# EAGLE design mubi-bot-PICO-3 (EAGLE 7.2.0)
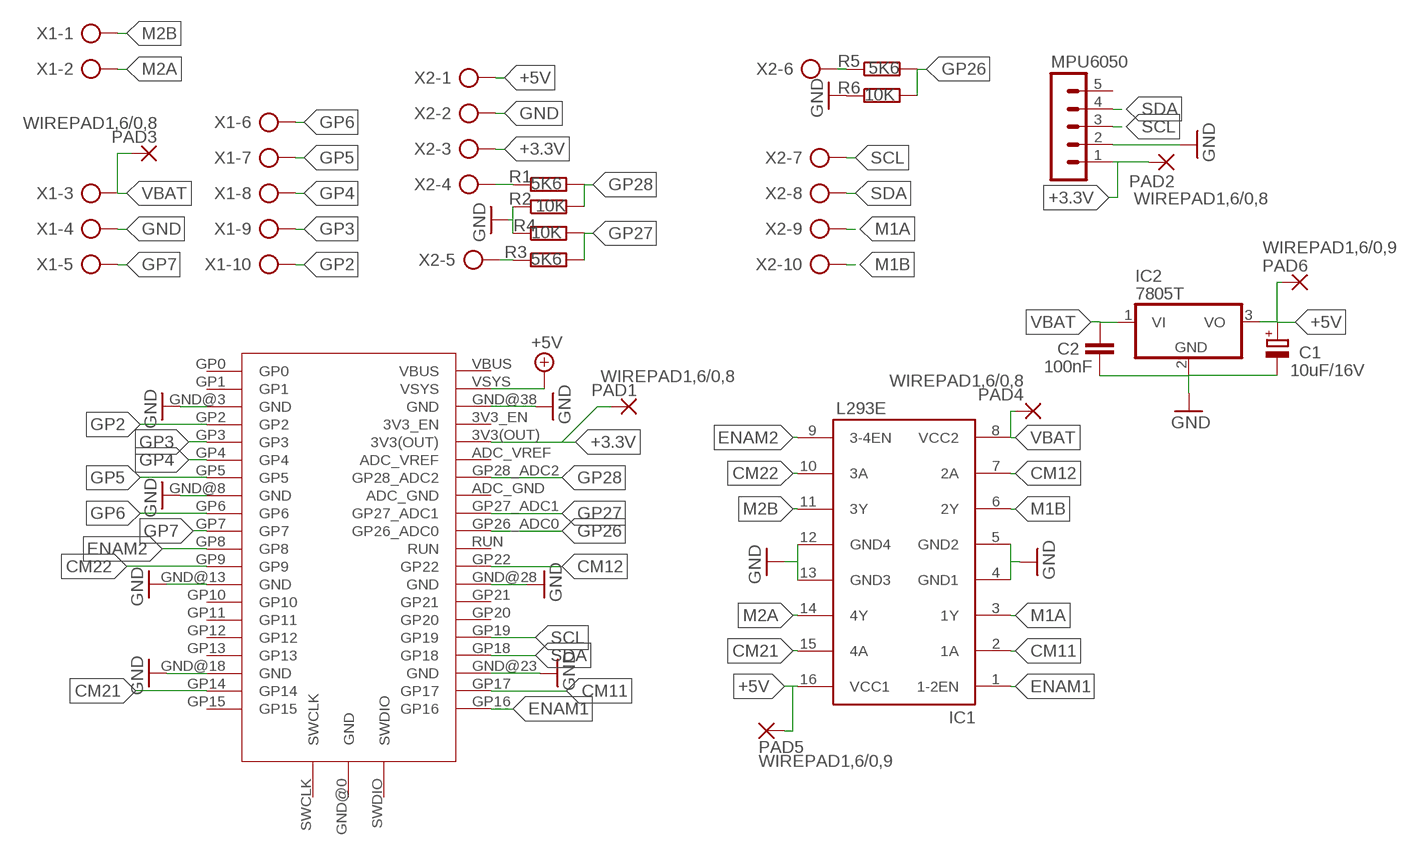
[diagram p0: schematic, sheet 1]

## Parts
C1  10uF/16V  CPOL-EUE2.5-5  [E2,5-5]
C2  100nF  C-EU025-025X050  [C025-025X050]
IC1  L293E  [DIL16]
IC2  7805T  [TO220H]
MPU6050  MA05-1  [MA05-1]
PAD1  WIREPAD1,6/0,8  [1,6/0,8]
PAD2  WIREPAD1,6/0,8  [1,6/0,8]
PAD3  WIREPAD1,6/0,8  [1,6/0,8]
PAD4  WIREPAD1,6/0,8  [1,6/0,8]
PAD5  WIREPAD1,6/0,9  [1,6/0,9]
PAD6  WIREPAD1,6/0,9  [1,6/0,9]
R1  5K6  R-EU_0204/5  [0204/5]
R2  10K  R-EU_0204/5  [0204/5]
R3  5K6  R-EU_0204/5  [0204/5]
R4  10K  R-EU_0204/5  [0204/5]
R5  5K6  R-EU_0204/5  [0204/5]
R6  10K  R-EU_0204/5  [0204/5]
U$2  RASPBERRY_PI_PICO  [RASPBERRY_PI_PICO_FOOTPRINT]
X1  AK500/10-H  [AK500/10-H]
X2  AK500/10-H  [AK500/10-H]

## Nets
+3.3V: MPU6050.1 PAD1.1(P) PAD2.1(P) U$2.3V3(OUT) X2.3
+5V: C1.+ IC1.16(VCC1) IC2.3(VO) PAD5.1(P) PAD6.1(P) U$2.VSYS X2.1
CM11: IC1.2(1A) U$2.GP17
CM12: IC1.7(2A) U$2.GP22
CM21: IC1.15(4A) U$2.GP14
CM22: IC1.10(3A) U$2.GP9
ENAM1: IC1.1(1-2EN) U$2.GP16
ENAM2: IC1.9(3-4EN) U$2.GP8
GND: C1.- C2.2 IC1.4(GND1) IC1.5(GND2) IC1.12(GND4) IC1.13(GND3) IC2.2(GND) MPU6050.2 R2.1 R4.1 R6.1 U$2.GND@3(GND) U$2.GND@8(GND) U$2.GND@13(GND) U$2.GND@18(GND) U$2.GND@23(GND) U$2.GND@28(GND) U$2.GND@38(GND) X1.4 X2.2
GP2: U$2.GP2 X1.10
GP3: U$2.GP3 X1.9
GP4: U$2.GP4 X1.8
GP5: U$2.GP5 X1.7
GP6: U$2.GP6 X1.6
GP7: U$2.GP7 X1.5
GP26: R5.2 R6.2 U$2.GP26_ADC0
GP27: R3.2 R4.2 U$2.GP27_ADC1
GP28: R1.2 R2.2 U$2.GP28_ADC2
M1A: IC1.3(1Y) X2.9
M1B: IC1.6(2Y) X2.10
M2A: IC1.14(4Y) X1.2
M2B: IC1.11(3Y) X1.1
N$1: R1.1 X2.4
N$2: R3.1 X2.5
N$3: R5.1 X2.6
SCL: MPU6050.3 U$2.GP19 X2.7
SDA: MPU6050.4 U$2.GP18 X2.8
VBAT: C2.1 IC1.8(VCC2) IC2.1(VI) PAD3.1(P) PAD4.1(P) X1.3
Unconnected: MPU6050.5 U$2.3V3_EN U$2.ADC_GND U$2.ADC_VREF U$2.GND@0(GND) U$2.GP0 U$2.GP1 U$2.GP10 U$2.GP11 U$2.GP12 U$2.GP13 U$2.GP15 U$2.GP20 U$2.GP21 U$2.RUN U$2.SWCLK U$2.SWDIO U$2.VBUS

## Library data of the parts
C1 = rcl:CPOL-EU: POLARIZED CAPACITOR, European symbol
C2 = rcl:C-EU: CAPACITOR, European symbol
IC1 = texas:L293E: TI DEVICE; MF: Arrow Electronics; MPN: L293E; OC_FARNELL: 1467711; OC_NEWARK: 89K0732
IC2 = linear:78*: Positive VOLTAGE REGULATOR Source: http://cache.national.com/ds/LM/LM78L05.pdf http://www.fairchildsemi.com/ds/LM/LM7805.pdf
MPU6050 = con-lstb:MA05-1: PIN HEADER; OC_FARNELL: unknown; OC_NEWARK: unknown
PAD1-PAD6 = wirepad:WIREPAD: Wire PAD connect wire on PCB
R1-R6 = resistor:R-EU_: RESISTOR, European symbol
U$2 = Raspberry Pi Pico v1:RASPBERRY_PI_PICO
X1 X2 = con-ptr500:AK500/10-H: CONNECTOR Aug. 2004 / PTR Meßtechnik: Die Bezeichnung der Serie AK505 wurde geändert. Es handelt sich hierbei um AK500 in horizontaler Ausführung.; OC_FARNELL: unknown; OC_NEWARK: unknown

## Net classes
0 default: clearance 0.205 mm

## Board
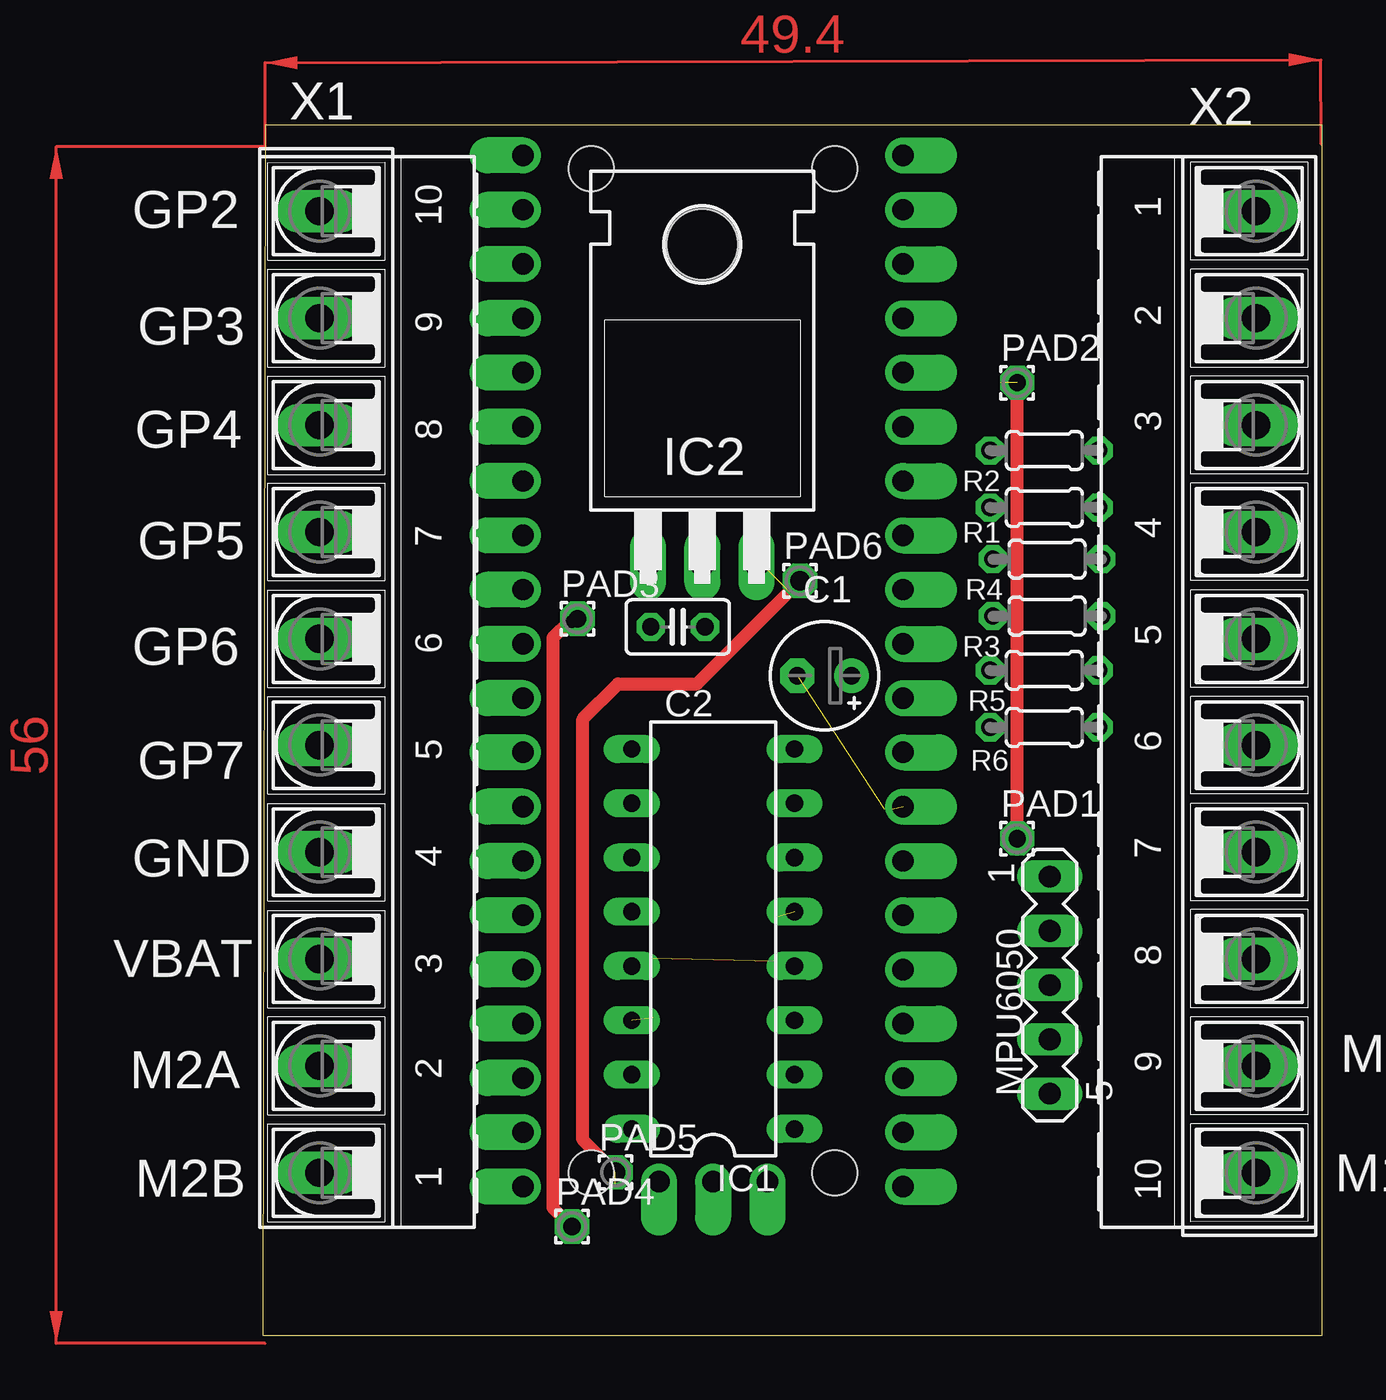
[diagram p1: board, top side]
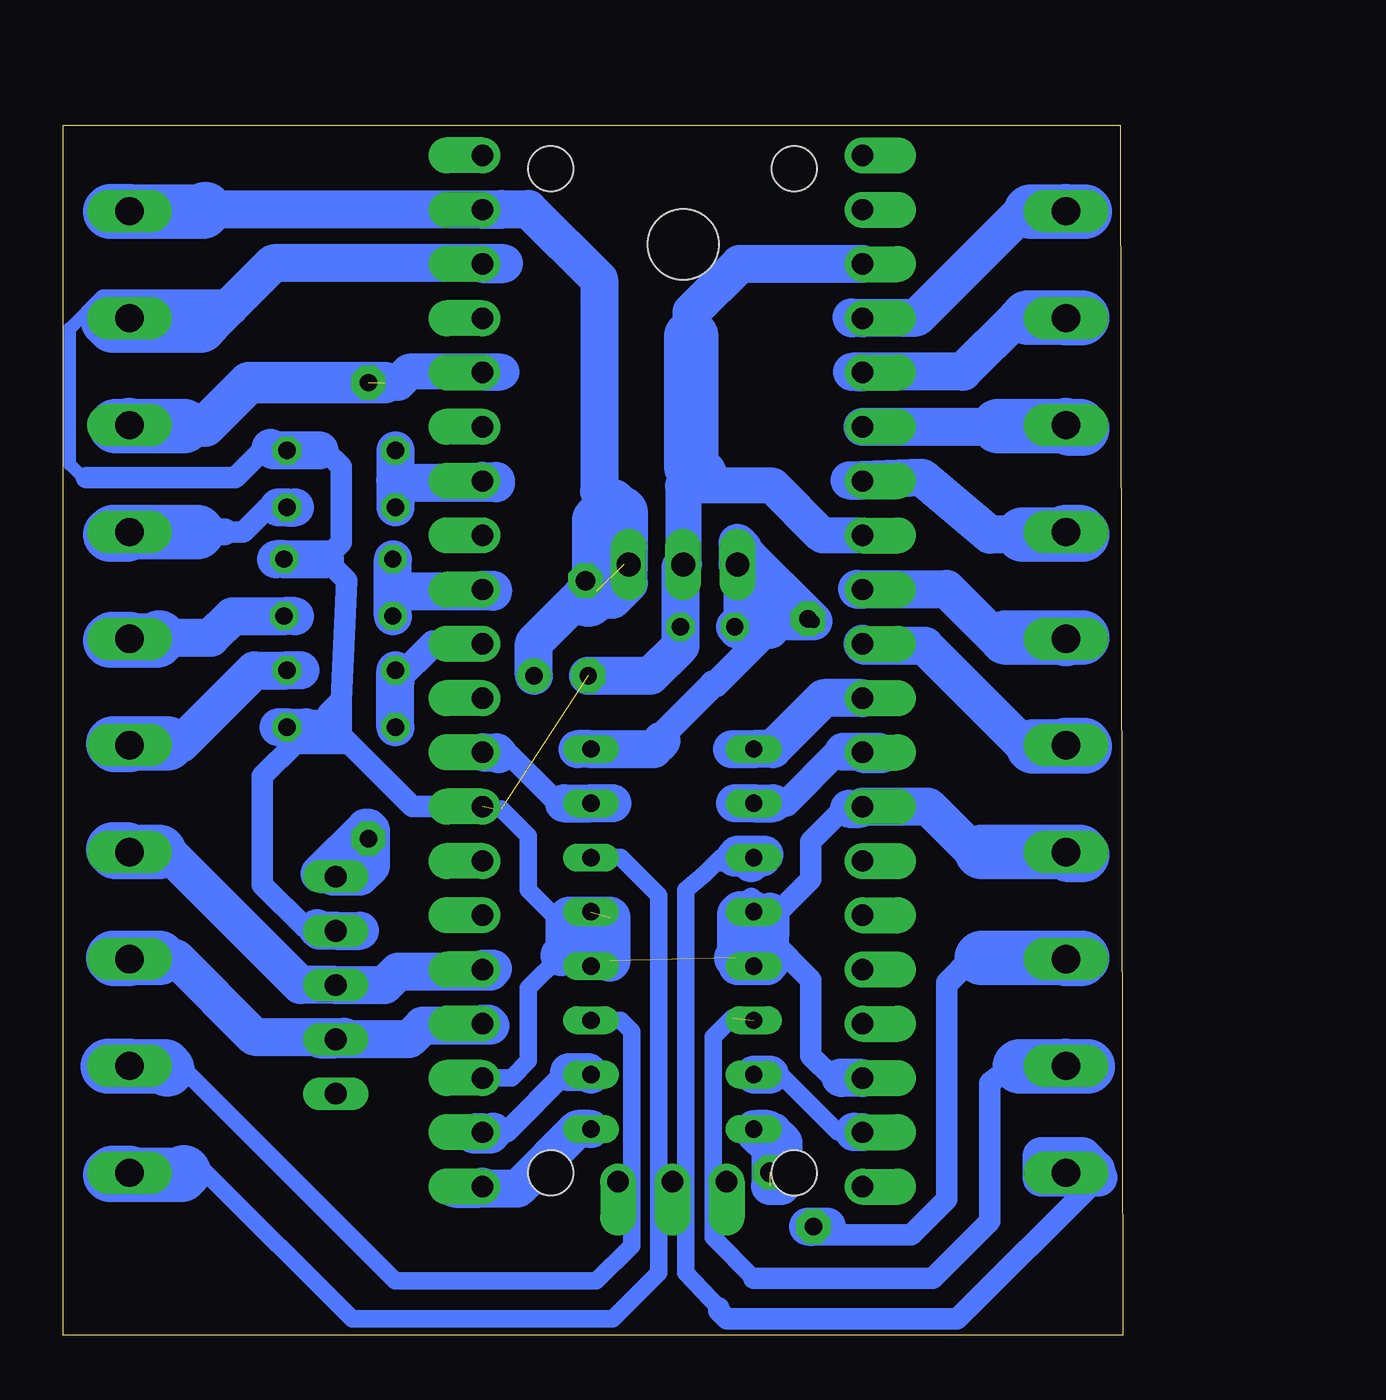
[diagram p2: board, bottom side, seen from below]

Size 49.58 x 56.63 mm. Coordinates in mm from the lower left corner, seen from the top.
Outline: 0,0 49.58,0 49.58,56.63 0.13,56.63 0,0
Copper layers (1*16): Top 0.035mm / dielectric 1.5mm / Bottom 0.035mm
Design rules "default": minimum track width 6mil, minimum drill 0.35mm, track to track 6mil, track to pad 6mil, pad to pad 6mil, via to via 6mil, smd to smd 6mil, copper to edge 40mil, drill to drill 6mil, minimum pad ring 10mil, minimum via ring 8mil, stop-mask expansion 4mil, vias tented up to drill 0mil, thermal gap 10mil

### Footprints (pad centres in the part's own frame; a part is rotated, then mirrored left to right if it is on the bottom)
E2,5-5 = drill 0.813 pad 1.6: + -1.27,0 | drill 0.813 pad 1.6 octagon: - 1.27,0
C025-025X050 = drill 0.813 octagon: 1 -1.27,0; 2 1.27,0
DIL16 = drill 0.813 long: 1 -8.89,-3.81; 2 -6.35,-3.81; 3 -3.81,-3.81; 4 -1.27,-3.81; 5 1.27,-3.81; 6 3.81,-3.81; 7 6.35,-3.81; 8 8.89,-3.81; 9 8.89,3.81; 10 6.35,3.81; 11 3.81,3.81; 12 1.27,3.81; 13 -1.27,3.81; 14 -3.81,3.81; 15 -6.35,3.81; 16 -8.89,3.81
TO220H = drill 1.118 long: 1 -2.54,-10.16; 2 0,-10.16; 3 2.54,-10.16 | hole 3.302: 0,4.826
MA05-1 = drill 1.016 long: 1 -5.08,0; 2 -2.54,0; 3 0,0; 4 2.54,0; 5 5.08,0
1,6/0,8 = drill 0.813 pad 1.6 octagon: 1 0,0
1,6/0,9 = drill 0.914 pad 1.6 octagon: 1 0,0
0204/5 = drill 0.813 octagon: 1 -2.54,0; 2 2.54,0
RASPBERRY_PI_PICO_FOOTPRINT = drill 1 pad 1.676 offset: 3V3(OUT) 8.89,39.465; 3V3_EN 8.89,42.005; ADC_GND 8.89,31.845; ADC_VREF 8.89,36.925; GND@0 0,1.6; GND@3 -8.89,44.545; GND@8 -8.89,31.845; GND@13 -8.89,19.145; GND@18 -8.89,6.445; GND@23 8.89,6.445; GND@28 8.89,19.145; GND@38 8.89,44.545; GP0 -8.89,49.625; GP1 -8.89,47.085; GP2 -8.89,42.005; GP3 -8.89,39.465; GP4 -8.89,36.925; GP5 -8.89,34.385; GP6 -8.89,29.305; GP7 -8.89,26.765; GP8 -8.89,24.225; GP9 -8.89,21.685; GP10 -8.89,16.605; GP11 -8.89,14.065; GP12 -8.89,11.525; GP13 -8.89,8.985; GP14 -8.89,3.905; GP15 -8.89,1.365; GP16 8.89,1.365; GP17 8.89,3.905; GP18 8.89,8.985; GP19 8.89,11.525; GP20 8.89,14.065; GP21 8.89,16.605; GP22 8.89,21.685; GP26_ADC0 8.89,26.765; GP27_ADC1 8.89,29.305; GP28_ADC2 8.89,34.385; RUN 8.89,24.225; SWCLK -2.54,1.6; SWDIO 2.54,1.6; VBUS 8.89,49.625; VSYS 8.89,47.085 | hole 2.1: 5.7,2; 5.7,49; -5.7,49; -5.7,2
AK500/10-H = drill 1.321 long: 1 -22.504,0; 2 -17.501,0; 3 -12.497,0; 4 -7.493,0; 5 -2.489,0; 6 2.489,0; 7 7.493,0; 8 12.497,0; 9 17.501,0; 10 22.504,0

### Placement (x,y rotation side)
C1  26.29,30.86 180 top
C2  19.43,33.15 0 top
IC1  21.08,18.54 90 top
IC2  20.57,46.23 0 top
MPU6050  36.83,16.38 270 top
PAD1  35.31,23.24 0 top
PAD2  35.31,44.58 0 top
PAD3  14.73,33.53 0 top
PAD4  14.48,5.08 0 top
PAD5  16.51,7.62 0 top
PAD6  25.15,35.31 0 top
R1  36.58,38.73 180 top
R2  36.58,41.4 180 top
R3  36.7,33.66 180 top
R4  36.7,36.32 180 top
R5  36.58,31.11 180 top
R6  36.58,28.45 180 top
U$2  21.08,5.59 0 top
X1  2.67,30.1 90 top
X2  46.48,30.1 270 top

### Tracks (layer width: path | path; a pad name or v marks a point on that pad's centre or on a via)
+3.3V  (1 unrouted)
  Top 0.61: PAD1.1 PAD2.1
  Bottom 1.676: U$2.3V3(OUT) 29.12,45.05 29.08,45.09 33.4,45.09 33.91,44.58 34.54,44.58
  Bottom 1.778: MPU6050.1 35.69,21.46 35.18,21.97 35.18,23.62 35.31,23.75 35.43,23.75 37.59,21.59 37.08,21.59 36.96,21.46 36.96,21.59 PAD1.1
  Bottom 1.93: 34.54,44.58 40.89,44.58 42.93,42.55 43.94,42.55
  Bottom 2.54: 43.94,42.55 46.53,42.55 | 47.12,42.55 46.53,42.55 | 46.53,42.55 X2.3
+5V  (2 unrouted)
  Top 0.61: PAD5.1 14.99,9.14 14.99,28.83 16.64,30.48 20.32,30.48 PAD6.1 25.27,35.43 25.27,35.31
  Bottom 1.778: C1.+ 27.56,32.39 25.53,34.42 25.02,34.42 23.88,34.42 23.11,35.18 IC2.3 23.11,37.34 | 42.93,52.7 29.08,52.7 | 29.08,52.7 27.81,52.7 24.51,49.4 24.51,39.5 23.5,38.48 | U$2.VSYS 29.12,52.67 29.08,52.7 | IC1.16 17.27,9.53 16.51,8.76 16.51,6.98 16,6.98 15.88,7.11 15.88,9.02 16.38,9.53 16.51,9.53 16.64,9.65 17.14,9.65
  Bottom 2.184: 24.7,34.73 24.7,38.16 23.88,38.99 23.88,36.58 23.37,36.07
  Bottom 2.54: X2.1 47.35,52.6 47.37,52.58 43.05,52.58 42.93,52.7 | 23.5,38.48 23.5,35.94 24.7,34.73 25.02,34.42
CM11
  Bottom 1.016: 29.46,9.53 28.83,9.53 26.04,12.32 25.91,12.32
  Bottom 1.778: U$2.GP17 30.26,9.49 30.35,9.4 29.59,9.4 29.46,9.53 | 25.91,12.32 25.02,12.32 IC1.2
CM12
  Bottom 1.016: 29.21,27.18 28.7,27.18 26.42,24.89 26.16,24.89
  Bottom 1.778: U$2.GP22 29.3,27.27 29.21,27.18 | 26.16,24.89 IC1.7 23.88,24.89
CM21
  Bottom 0.813: 12.57,9.53 13.34,9.53 16,12.19 16.51,12.19
  Bottom 1.778: U$2.GP14 12.57,9.49 12.57,9.53 | 16.51,12.19 IC1.15
CM22
  Bottom 1.27: 16.38,24.89 15.75,24.89 13.34,27.31 13.08,27.31
  Bottom 1.778: 18.16,24.89 IC1.10 16.38,24.89 | 13.08,27.31 11.43,27.31 11.3,27.18 12.1,27.18 U$2.GP9
ENAM1
  Bottom 1.778: IC1.1 25.53,9.65 28.32,6.86 30.07,6.86 | 31.24,6.86 30.07,6.86 | 30.07,6.86 U$2.GP16
ENAM2
  Bottom 1.778: U$2.GP8 14,29.81 16.38,27.43 IC1.9 18.29,27.43
GND  (4 unrouted)
  Bottom 0.61: 48.51,40.13 48.64,40.13 49.28,40.77 49.28,47.12 47.75,48.64 42.29,48.64 41.78,48.13
  Bottom 0.813: U$2.GND@23 28.61,12.03 27.81,12.83 27.81,16.26 26.29,17.78 25.53,18.54 | IC1.4 24.89,17.91 27.81,20.83 27.81,23.37 29.08,24.64 29.46,24.64 | IC1.12 17.27,20.32 17.4,20.45
  Bottom 1.016: 17.4,20.45 17.4,19.81 16.64,19.05 16.64,19.3 14.61,21.34 14.61,23.11 13.08,24.64 12.83,24.64 | 37.59,41.4 37.34,41.4 36.58,40.64 36.58,37.08 37.34,36.32 36.32,35.31 36.58,29.72 | 38.23,28.45 38.1,28.45 | 36.58,29.72 36.58,28.07 36.2,27.69 | U$2.GND@28 33.24,24.73 36.2,27.69 | 37.21,28.45 37.21,29.08 36.58,29.72 | 37.72,19.05 38.23,19.05 40.26,21.08 40.26,26.16 38.73,27.69 36.2,27.69 | 13.21,12.07 13.59,12.07 14.61,13.08 14.61,16.64 16.51,18.54 | 39.88,41.53 40.13,41.53 41.53,40.13 48.51,40.13
  Bottom 1.676: U$2.GND@8 14.07,37.43 16.38,39.75 20.07,39.75 20.32,40.01 20.57,39.75 IC2.2 | 38.1,28.45 37.21,28.45
  Bottom 1.778: 12.83,24.64 12.29,24.64 U$2.GND@13 9.11,24.73 6.98,22.61 6.6,22.61 | IC2.2 20.7,35.94 C2.2 20.7,32.26 22.1,30.86 C1.- | 39.62,36.32 R4.1 37.34,36.32 | 37.59,41.4 R2.1 39.75,41.4 39.88,41.53 | 39.5,28.45 R6.1 38.23,28.45 | 35.69,18.92 MPU6050.2 37.59,18.92 37.72,19.05 | U$2.GND@38 28.99,50.13 28.96,50.17 39.75,50.17 41.78,48.13 42.67,47.24 43.18,47.24 | U$2.GND@3 17.94,50.13 20.19,47.88 20.19,46.74 | 19.81,40.26 20.07,40.26 20.32,40.01 | 18.03,17.78 18.03,17.27 IC1.13 | IC1.13 16.64,17.27 16.51,17.4 16.51,18.54 16.51,18.67 | 16.51,19.81 16.51,18.67 | IC1.13 17.27,17.91 16.51,18.67 | U$2.GND@18 13.18,12.03 13.21,12.07
  Bottom 1.93: IC1.12 17.91,19.81 18.03,19.68 18.03,17.78 18.16,17.65 | 24.89,17.91 24.38,17.91 24,17.53 24,19.56 25.91,19.56 26.04,19.43 26.04,18.03 26.29,17.78
  Bottom 2.54: 6.6,22.61 X1.4 | X1.4 2.03,22.61 1.91,22.48 2.54,22.48 X1.4 | 43.18,47.24 47.24,47.24 47.5,47.5 46.58,47.5 X2.2 | 20.19,46.74 20.19,40.64 19.81,40.26
GP2
  Bottom 1.778: U$2.GP2 12.67,47.59 12.7,47.62 9.65,47.62 4.7,52.58 4.32,52.58
  Bottom 2.54: 4.32,52.58 2.64,52.58 | 1.78,52.58 2.64,52.58 | 2.64,52.58 X1.10
GP3
  Bottom 1.778: 4.44,47.62 4.95,47.62 7.49,45.09 12.67,45.09 U$2.GP3
  Bottom 2.54: X1.9 1.93,47.6 1.91,47.62 4.44,47.62
GP4
  Bottom 1.778: U$2.GP4 6.51,42.51 5.84,42.55
  Bottom 2.54: 5.84,42.55 2.03,42.55 1.91,42.42 2.49,42.42 X1.8
GP5
  Bottom 1.778: 4.7,37.47 6.22,37.47 9.4,40.13 12.79,40.01 U$2.GP5
  Bottom 2.54: X1.7 2.03,37.59 1.91,37.47 4.7,37.47
GP6
  Bottom 1.778: U$2.GP6 12.41,34.89 12.45,34.92 8.26,34.92 5.97,32.64 5.46,32.64
  Bottom 2.54: 5.46,32.64 2.62,32.64 | 1.91,32.64 2.62,32.64 | 2.62,32.64 X1.6
GP7
  Bottom 1.778: 4.19,27.56 4.57,27.56 9.27,32.26 12.1,32.26 U$2.GP7
  Bottom 2.54: X1.5 1.83,27.61 1.78,27.56 4.19,27.56
GP26
  Bottom 1.27: U$2.GP26_ADC0 32.29,32.35 34.04,30.61
  Bottom 1.778: R6.2 34.04,30.61 R5.2
GP27
  Bottom 1.778: R3.2 34.16,34.8 | R4.2 34.16,34.92 34.16,34.8 | U$2.GP27_ADC1 29.46,34.89 29.46,34.8 34.16,34.8
GP28
  Bottom 1.778: R2.2 34.04,40.13 34.04,39.88 | 34.04,39.88 R1.2 | U$2.GP28_ADC2 29.34,39.97 29.34,39.88 34.04,39.88
M1A
  Bottom 0.813: IC1.3 23.5,14.73 22.99,14.22 22.99,4.19 24.64,2.54 34.04,2.54 43.94,12.45 44.7,12.45 45.08,12.45
  Bottom 2.54: X2.9 47.47,12.6 47.5,12.57 44.83,12.57 44.7,12.45
M1B
  Bottom 0.813: IC1.6 23.5,22.35 21.72,20.57 21.72,2.92 23.88,0.76 36.07,0.76 42.93,7.62 43.94,7.62 45.34,7.62 45.47,7.49
  Bottom 2.54: X2.10 47.27,7.6 47.37,7.49 44.07,7.49 43.94,7.62
M2A  (1 unrouted)
  Bottom 0.813: 17.27,2.67 19.18,4.57 19.18,13.97 18.29,14.86
  Bottom 1.016: 17.27,2.67 8.89,2.67 6.22,5.33 6.22,11.81 5.21,12.57
  Bottom 1.778: 5.21,12.57 4.83,12.57
  Bottom 2.54: 4.83,12.57 2.64,12.57 | 1.65,12.57 2.64,12.57 | 2.64,12.57 X1.2
M2B
  Bottom 0.813: 18.92,1.27 20.45,2.92 20.45,20.83 19.56,21.59 19.05,22.1 | 19.05,22.1 18.8,22.35 | 17.4,22.1 19.05,22.1
  Bottom 1.016: 18.92,1.27 18.92,1.14 18.54,0.76 7.75,0.76 1.14,7.37
  Bottom 1.778: IC1.11 16.89,22.35 16.76,22.48 18.03,22.48 18.16,22.35 17.65,22.35 17.4,22.1 | 1.14,7.37 3.81,7.37 3.81,8.38 1.91,8.38 1.27,7.75 2.51,7.75 X1.1
N$1
  Bottom 1.016: 39.5,38.73 40,38.73 41.15,37.59 42.04,37.59
  Bottom 1.27: 42.04,37.59 43.31,37.59
  Bottom 1.778: 38.73,38.73 R1.1 39.5,38.73
  Bottom 2.54: 43.31,37.59 X2.4 | X2.4 47.24,37.59 47.37,37.47 46.61,37.47 X2.4
N$2
  Bottom 1.778: 45.08,32.64 42.67,32.64 41.66,33.66 R3.1 38.73,33.66
  Bottom 2.54: X2.5 47.29,32.59 47.37,32.51 45.21,32.51 45.08,32.64
N$3
  Bottom 1.778: 44.7,27.69 44.07,27.69 40.64,31.11 R5.1 38.48,31.11
  Bottom 2.54: X2.6 47.17,27.61 47.24,27.69 44.7,27.69
SCL
  Bottom 1.778: U$2.GP19 29.94,17.14 29.46,17.14 29.59,17.02 33.91,17.02 34.54,16.38 MPU6050.3 38.48,16.38 44.58,22.48 44.96,22.48 45.08,22.61
  Bottom 2.54: 45.08,22.61 X2.7 | X2.7 47.12,22.61 47.24,22.73 46.61,22.73 X2.7
SDA
  Bottom 1.778: U$2.GP18 29.69,14.57 29.59,14.48 32.77,14.48 33.4,13.84 36.32,13.84 | 36.32,13.84 MPU6050.4 37.59,13.84 | 45.08,17.65 44.32,17.65 40.64,13.97 36.45,13.97 36.32,13.84
  Bottom 2.54: X2.8 47.19,17.6 47.24,17.65 45.08,17.65
VBAT  (via drill 0.6)
  Top 0.61: v14.48,33.4 14.35,33.4 13.59,32.64 13.59,5.97 PAD4.1
  Bottom 1.016: 14.73,5.21 14.73,5.08 14.35,4.7 9.91,4.7 8.26,6.35 8.26,16.51 7.11,17.65 | 7.11,17.65 6.6,17.65 | 7.11,17.65 7.11,17.53 8.13,16.51
  Bottom 1.27: 21.59,27.81 21.59,28.07 19.18,30.48 19.05,30.48 16.51,33.02
  Bottom 1.778: 25.53,27.43 IC1.8 21.97,27.43 21.59,27.81 | 16.51,33.02 18.03,33.02 C2.1 17.91,33.15 17.78,33.27 17.78,35.43 | 17.78,35.43 17.78,36.83 18.03,37.08 IC2.1 | PAD3.1 14.73,33.66 | 14.73,33.66 17.53,36.45 | 14.73,33.66 v14.48,33.4 15.75,33.4 17.78,35.43 | 14.73,5.08 PAD4.1 13.84,5.08
  Bottom 2.54: X1.3 1.96,17.6 1.91,17.65 6.6,17.65
(copper drawn outside any net)
  shapes: Top area x2

### Text on the board
tNames: GP2 | GP3 | GP4 | GP5 | GP6 | GP7 | GND | VBAT | M1A | M2A | M2B | M1B
tValues: +5V_out | GND | +3,3V_out | GP28 | GP27 | GP26 | SCL_GP19 | SDA_GP18